# EAGLE design oled_block (EAGLE 6.6.0)

## Sheet 1 of 2
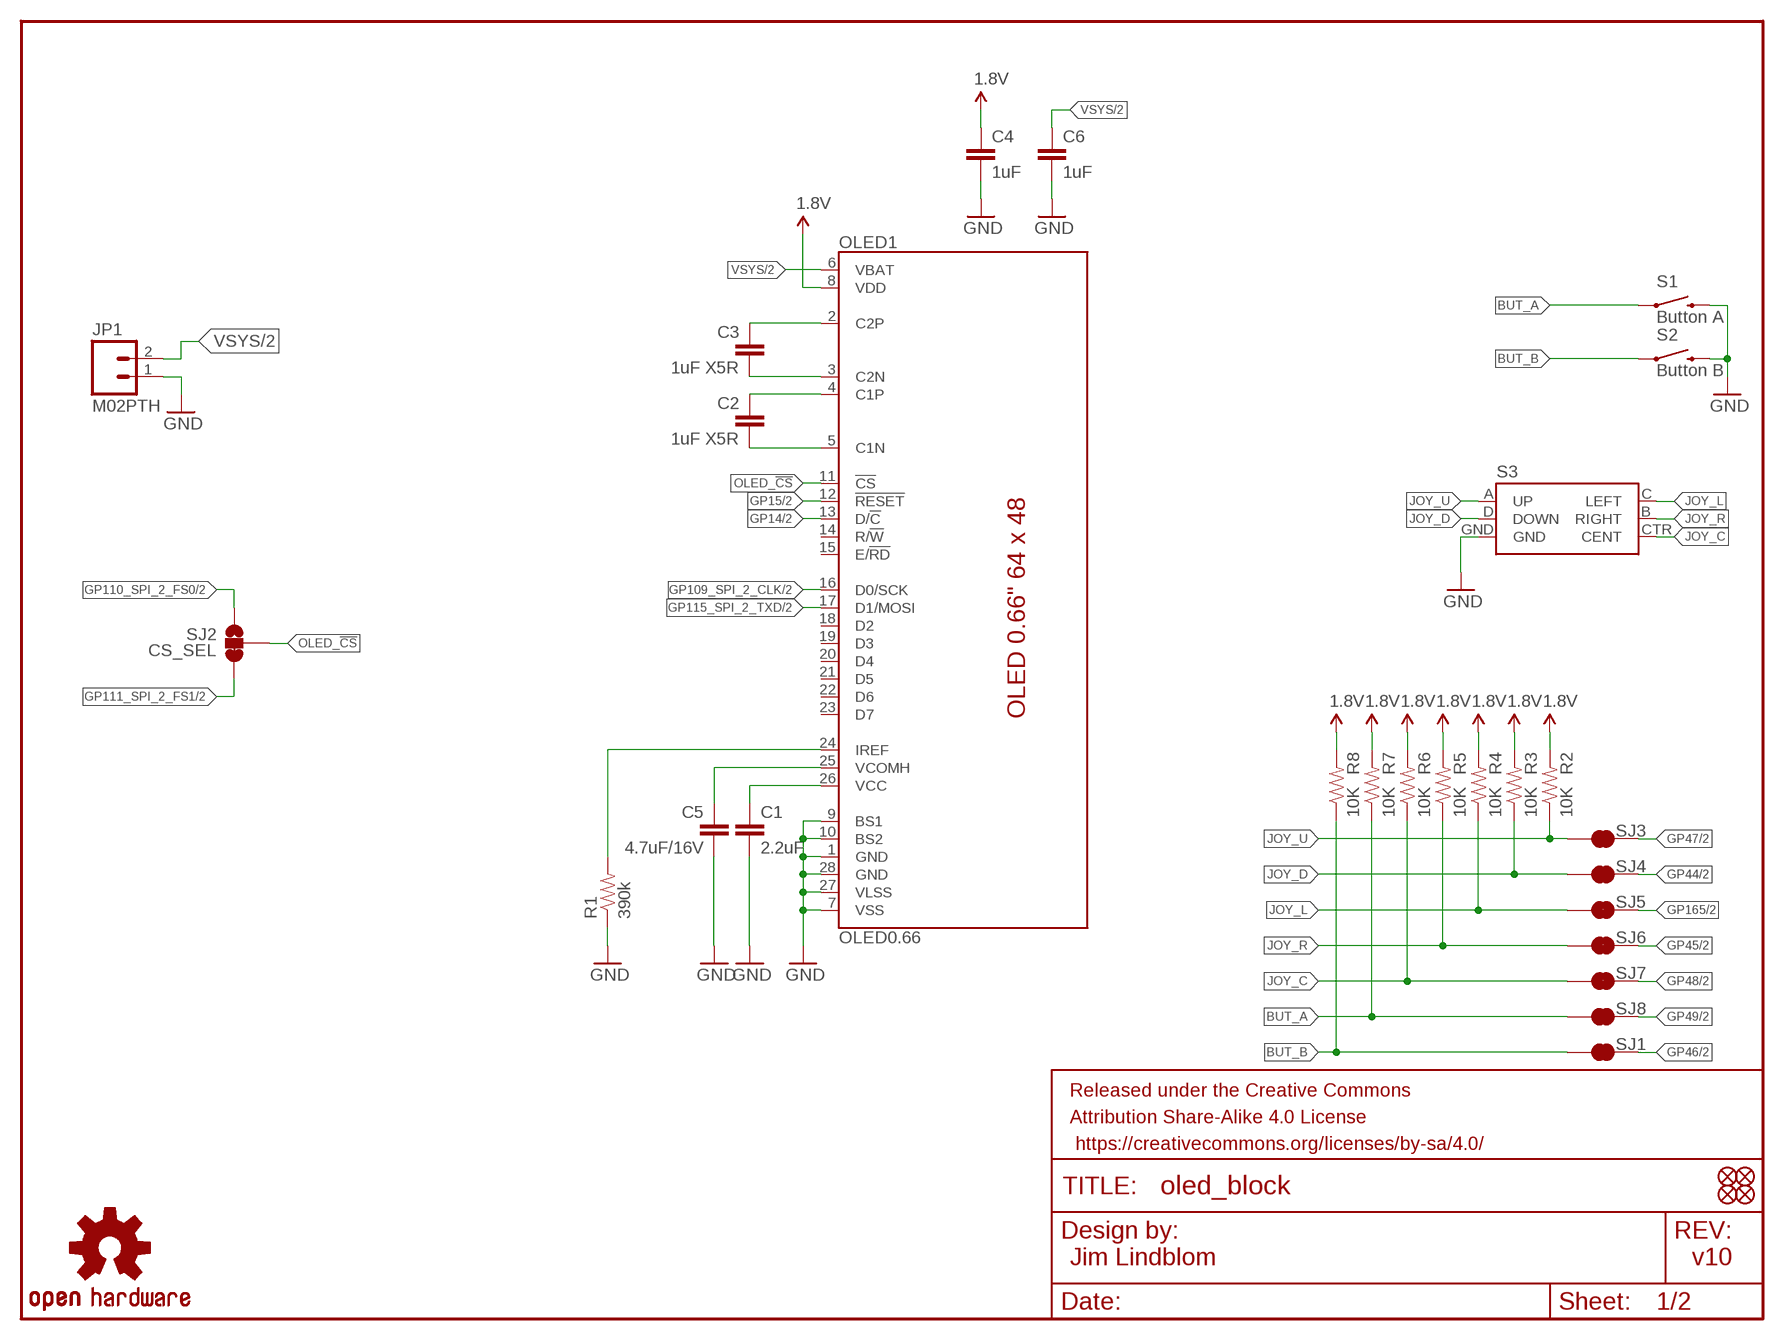
[diagram p0: schematic, sheet 1]

### Parts
C1  2.2uF  CAP0805  [0805]
C2  1uF X5R  CAP0805  [0805]
C3  1uF X5R  CAP0805  [0805]
C4  1uF  CAP0603-CAP  [0603-CAP]
C5  4.7uF/16V  CAP1206  [1206]
C6  1uF  CAP0603-CAP  [0603-CAP]
FID1  FIDUCIAL1X2  [FIDUCIAL-1X2]
FID2  FIDUCIAL1X2  [FIDUCIAL-1X2]
FID3  FIDUCIAL1X2  [FIDUCIAL-1X2]
FID4  FIDUCIAL1X2  [FIDUCIAL-1X2]
FRAME1  FRAME-LETTER  [CREATIVE_COMMONS]
JP1  M02PTH  [1X02]
LOGO2  OSHW-LOGOS  [OSHW-LOGO-S]
OLED1  OLED0.66  [OLED-0.66-64X48]
R1  390k  RESISTOR0603-RES  [0603-RES]
R2  10K  10KOHM1/10W1%(0603)0603  [0603-RES]
R3  10K  10KOHM1/10W1%(0603)0603  [0603-RES]
R4  10K  10KOHM1/10W1%(0603)0603  [0603-RES]
R5  10K  10KOHM1/10W1%(0603)0603  [0603-RES]
R6  10K  10KOHM1/10W1%(0603)0603  [0603-RES]
R7  10K  10KOHM1/10W1%(0603)0603  [0603-RES]
R8  10K  10KOHM1/10W1%(0603)0603  [0603-RES]
S1  Button A  SWITCH-MOMENTARY-2SMD-4  [TACTILE_SWITCH_TALL]
S2  Button B  SWITCH-MOMENTARY-2SMD-4  [TACTILE_SWITCH_TALL]
S3  JOYSTICK_MINI  [JOYSTICK_MINI]
SJ1  JUMPER-PAD-2-NC_BY_TRACE  [PAD-JUMPER-2-NC_BY_TRACE_YES_SILK]
SJ2  CS_SEL  JUMPER-PAD-3-2OF3_NC_BY_TRACE  [PAD-JUMPER-3-2OF3_NC_BY_TRACE_YES_SILK_FULL_BOX]
SJ3  JUMPER-PAD-2-NC_BY_TRACE  [PAD-JUMPER-2-NC_BY_TRACE_YES_SILK]
SJ4  JUMPER-PAD-2-NC_BY_TRACE  [PAD-JUMPER-2-NC_BY_TRACE_YES_SILK]
SJ5  JUMPER-PAD-2-NC_BY_TRACE  [PAD-JUMPER-2-NC_BY_TRACE_YES_SILK]
SJ6  JUMPER-PAD-2-NC_BY_TRACE  [PAD-JUMPER-2-NC_BY_TRACE_YES_SILK]
SJ7  JUMPER-PAD-2-NC_BY_TRACE  [PAD-JUMPER-2-NC_BY_TRACE_YES_SILK]
SJ8  JUMPER-PAD-2-NC_BY_TRACE  [PAD-JUMPER-2-NC_BY_TRACE_YES_SILK]

### Nets
1.8V: C4.1 OLED1.8(VDD) R2.2 R3.2 R4.2 R5.2 R6.2 R7.2 R8.2 ; also sheet 2
BUT_A: R7.1 S1.A2 SJ8.1
BUT_B: R8.1 S2.A2 SJ1.1
C1N: C2.2 OLED1.5(C1N)
C1P: C2.1 OLED1.4(C1P)
C2N: C3.2 OLED1.3(C2N)
C2P: C3.1 OLED1.2(C2P)
GND: C1.2 C4.2 C5.2 C6.2 JP1.1 OLED1.1(GND) OLED1.7(VSS) OLED1.9(BS1) OLED1.10(BS2) OLED1.27(VLSS) OLED1.28(GND) R1.1 S1.B2 S2.B2 S3.GND ; also sheet 2
GP14: OLED1.13(D/!C!) ; also sheet 2
GP15: OLED1.12(!RESET!) ; also sheet 2
GP44: SJ4.2 ; also sheet 2
GP45: SJ6.2 ; also sheet 2
GP46: SJ1.2 ; also sheet 2
GP47: SJ3.2 ; also sheet 2
GP48: SJ7.2 ; also sheet 2
GP49: SJ8.2 ; also sheet 2
GP109_SPI_2_CLK: OLED1.16(D0/SCK) ; also sheet 2
GP110_SPI_2_FS0: SJ2.1 ; also sheet 2
GP111_SPI_2_FS1: SJ2.3 ; also sheet 2
GP115_SPI_2_TXD: OLED1.17(D1/MOSI) ; also sheet 2
GP165: SJ5.2 ; also sheet 2
IREF: OLED1.24(IREF) R1.2
JOY_C: R6.1 S3.CTR(CENT) SJ7.1
JOY_D: R3.1 S3.D(DOWN) SJ4.1
JOY_L: R4.1 S3.C(LEFT) SJ5.1
JOY_R: R5.1 S3.B(RIGHT) SJ6.1
JOY_U: R2.1 S3.A(UP) SJ3.1
OLED_!CS!: OLED1.11(!CS!) SJ2.2
VCC: C1.1 OLED1.26(VCC)
VCOMH: C5.1 OLED1.25(VCOMH)
VSYS: C6.1 JP1.2 OLED1.6(VBAT) ; also sheet 2
Unconnected: OLED1.14(R/!W!) OLED1.15(E/!RD!) OLED1.18(D2) OLED1.19(D3) OLED1.20(D4) OLED1.21(D5) OLED1.22(D6) OLED1.23(D7)

### Notes on the sheet
- Jim Lindblom | v10

## Sheet 2 of 2
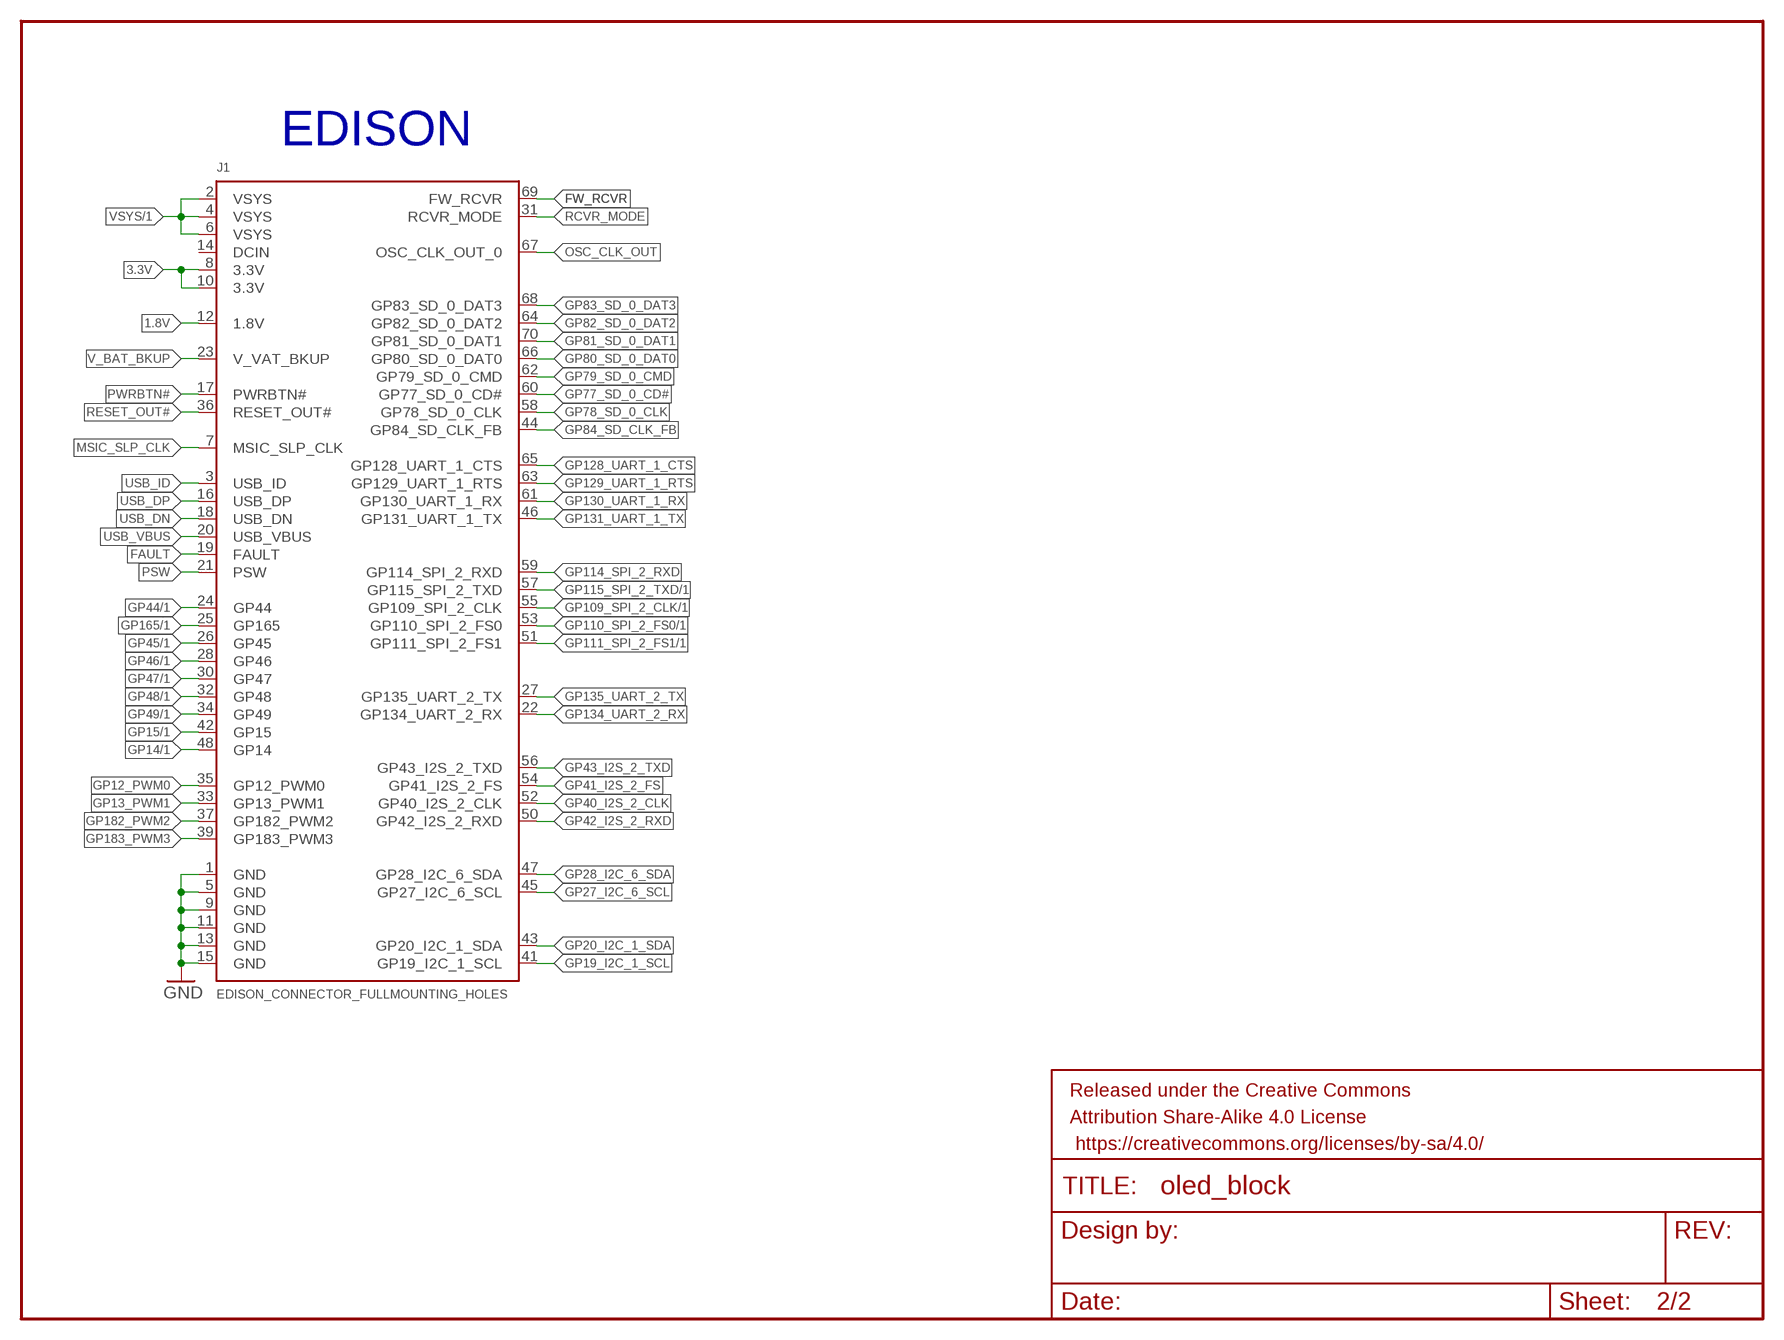
[diagram p1: schematic, sheet 2]

### Parts
FRAME2  FRAME-LETTER  [CREATIVE_COMMONS]
J1  EDISON_CONNECTOR_FULLMOUNTING_HOLES  [EDISON_DAUGHTER]

### Nets
1.8V: J1.12(1.8V) ; also sheet 1
3.3V: J1.8(3.3V) J1.10(3.3V)
FAULT: J1.19(FAULT)
FW_RCVR: J1.69(FW_RCVR)
GND: J1.1(GND) J1.5(GND) J1.9(GND) J1.11(GND) J1.13(GND) J1.15(GND) ; also sheet 1
GP12_PWM0: J1.35(GP12_PWM0)
GP13_PWM1: J1.33(GP13_PWM1)
GP14: J1.48(GP14) ; also sheet 1
GP15: J1.42(GP15) ; also sheet 1
GP19_I2C_1_SCL: J1.41(GP19_I2C_1_SCL)
GP20_I2C_1_SDA: J1.43(GP20_I2C_1_SDA)
GP27_I2C_6_SCL: J1.45(GP27_I2C_6_SCL)
GP28_I2C_6_SDA: J1.47(GP28_I2C_6_SDA)
GP40_I2S_2_CLK: J1.52(GP40_I2S_2_CLK)
GP41_I2S_2_FS: J1.54(GP41_I2S_2_FS)
GP42_I2S_2_RXD: J1.50(GP42_I2S_2_RXD)
GP43_I2S_2_TXD: J1.56(GP43_I2S_2_TXD)
GP44: J1.24(GP44) ; also sheet 1
GP45: J1.26(GP45) ; also sheet 1
GP46: J1.28(GP46) ; also sheet 1
GP47: J1.30(GP47) ; also sheet 1
GP48: J1.32(GP48) ; also sheet 1
GP49: J1.34(GP49) ; also sheet 1
GP77_SD_0_CD#: J1.60(GP77_SD_0_CD#)
GP78_SD_0_CLK: J1.58(GP78_SD_0_CLK)
GP79_SD_0_CMD: J1.62(GP79_SD_0_CMD)
GP80_SD_0_DAT0: J1.66(GP80_SD_0_DAT0)
GP81_SD_0_DAT1: J1.70(GP81_SD_0_DAT1)
GP82_SD_0_DAT2: J1.64(GP82_SD_0_DAT2)
GP83_SD_0_DAT3: J1.68(GP83_SD_0_DAT3)
GP84_SD_CLK_FB: J1.44(GP84_SD_CLK_FB)
GP109_SPI_2_CLK: J1.55(GP109_SPI_2_CLK) ; also sheet 1
GP110_SPI_2_FS0: J1.53(GP110_SPI_2_FS0) ; also sheet 1
GP111_SPI_2_FS1: J1.51(GP111_SPI_2_FS1) ; also sheet 1
GP114_SPI_2_RXD: J1.59(GP114_SPI_2_RXD)
GP115_SPI_2_TXD: J1.57(GP115_SPI_2_TXD) ; also sheet 1
GP128_UART_1_CTS: J1.65(GP128_UART_1_CTS)
GP129_UART_1_RTS: J1.63(GP129_UART_1_RTS)
GP130_UART_1_RX: J1.61(GP130_UART_1_RX)
GP131_UART_1_TX: J1.46(GP131_UART_1_TX)
GP134_UART_2_RX: J1.22(GP134_UART_2_RX)
GP135_UART_2_TX: J1.27(GP135_UART_2_TX)
GP165: J1.25(GP165) ; also sheet 1
GP182_PWM2: J1.37(GP182_PWM2)
GP183_PWM3: J1.39(GP183_PWM3)
MSIC_SLP_CLK: J1.7(MSIC_SLP_CLK)
OSC_CLK_OUT: J1.67(OSC_CLK_OUT_0)
PSW: J1.21(PSW)
PWRBTN#: J1.17(PWRBTN#)
RCVR_MODE: J1.31(RCVR_MODE)
RESET_OUT#: J1.36(RESET_OUT#)
USB_DN: J1.18(USB_DN)
USB_DP: J1.16(USB_DP)
USB_ID: J1.3(USB_ID)
USB_VBUS: J1.20(USB_VBUS)
V_BAT_BKUP: J1.23(V_VAT_BKUP)
VSYS: J1.2(VSYS) J1.4(VSYS) J1.6(VSYS) ; also sheet 1
Unconnected: J1.14(DCIN)

### Notes on the sheet
- EDISON

## Library data of the parts
C1-C6 = SparkFun-Passives:CAP: Capacitor Standard 0603 ceramic capacitor, and 0.1" leaded capacitor.
FID1-FID4 = SparkFun-Aesthetics:FIDUCIAL: Fiducial Alignment Points Various fiducial points for machine vision alignment.
FRAME1 FRAME2 = SparkFun-Aesthetics:FRAME-LETTER: Schematic Frame Standard 8.5x11 US Letter frame
J1 = Edison:EDISON_CONNECTOR_FULL
JP1 = SparkFun-Connectors:M02: Standard 2-pin 0.1" header. Use with - straight break away headers ( PRT-00116) - right angle break away headers (PRT-00553) - swiss pins (PRT-00743) - machine pins (PRT-00117) - female headers (PRT-00115) Molex polarized connector foot print use with: PRT-08233 with associated crimp pins and housings. 2.54_SCREWTERM for use with PRT-10571. 3.5mm Screw Terminal footprints for PRT-08084 5mm Screw Terminal footprints for use with PRT-08432
LOGO2 = SparkFun-Aesthetics:OSHW-LOGO: Open Source Hardware Logo This logo indicates the piece of hardware it is found on incorporates a OSHW license and/or adheres to the definition of open source hardware found here: http://freedomdefined.org/OSHW
OLED1 = SparkFun-Displays:OLED0.66
R1 = SparkFun-Passives:RESISTOR: Resistor Basic schematic elements and footprints for 0603, 1206, and PTH resistors.
R2-R8 = SparkFun-Resistors:10KOHM1/10W1%(0603): RES-00824; PROD_ID: RES-00824
S1 S2 = SparkFun-Electromechanical:SWITCH-MOMENTARY-2: Various NO switches- pushbuttons, reed, etc; PROD_ID: SWCH-11966
S3 = SparkFun-Electromechanical:JOYSTICK_MINI: Small 5-way tactile joystick, COM-10063 4UCON SF303GJ26
SJ1 SJ3-SJ8 = SparkFun-Passives:JUMPER-PAD-2-NC_BY_TRACE
SJ2 = SparkFun-Passives:JUMPER-PAD-3-2OF3_NC_BY_TRACE

## Board
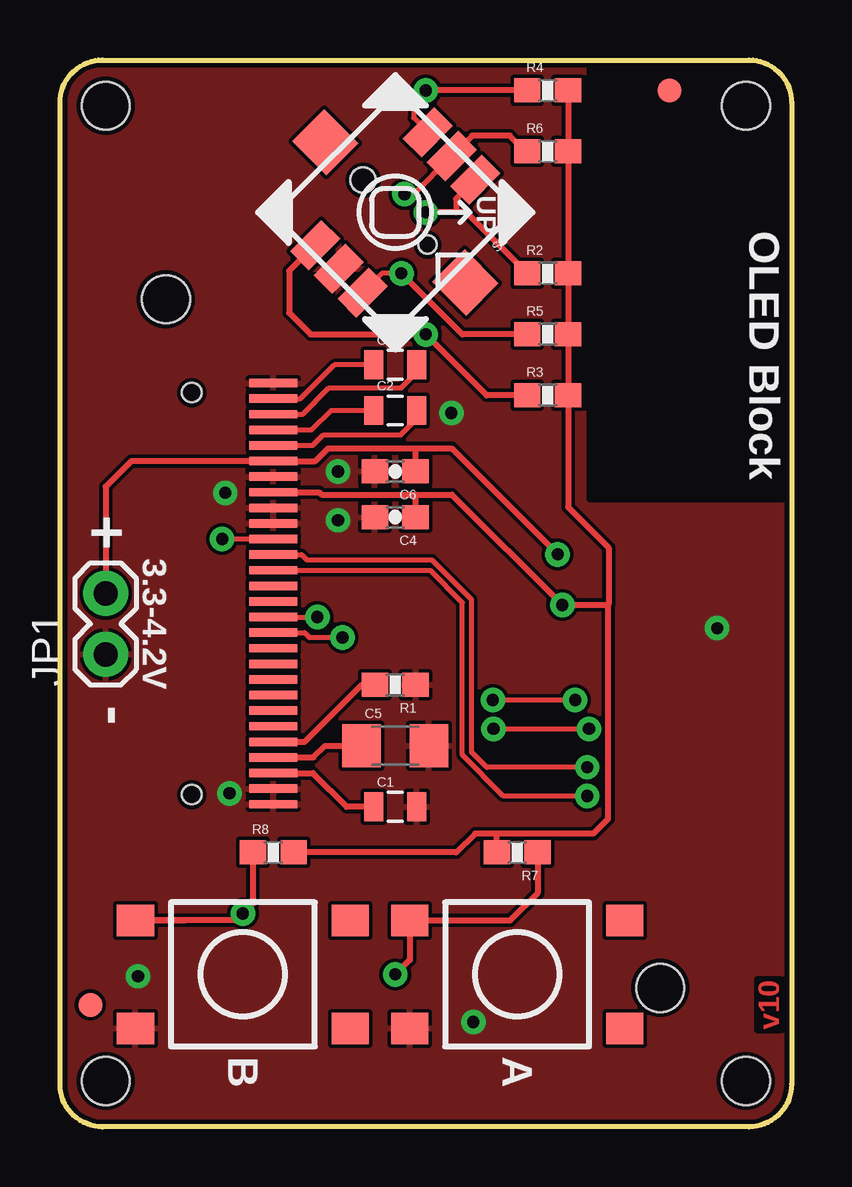
[diagram p2: board, top side]
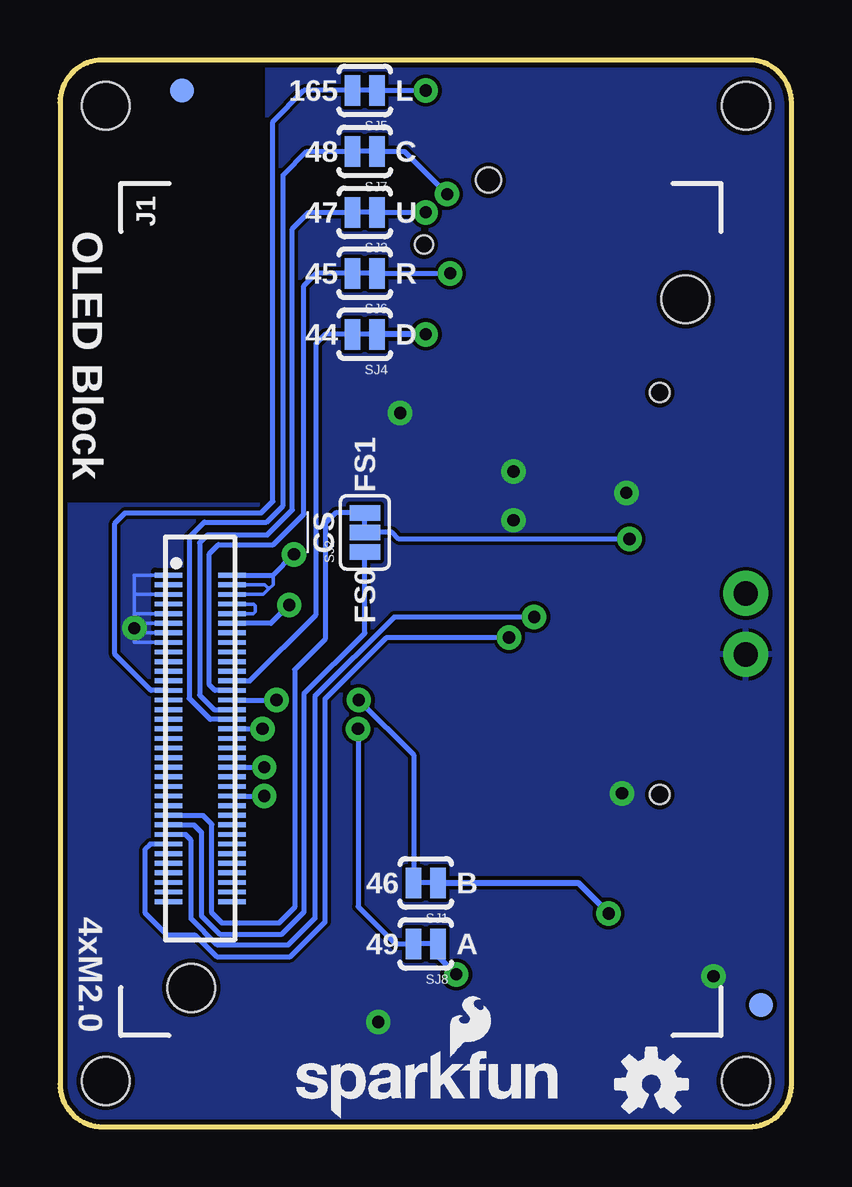
[diagram p3: board, bottom side, seen from below]

Size 30.48 x 44.45 mm. Coordinates in mm from the lower left corner, seen from the top.
Outline: 30.48,42.67 30.48,1.78 arc-90 28.7,0 1.78,0 arc-90 0,1.78 0,42.67 arc-90 1.78,44.45 28.7,44.45 arc-90 30.48,42.67
Copper layers (1*16): Top 0.035mm / dielectric 1.5mm / Bottom 0.035mm
Design rules "SparkFun-2-layer *": minimum track width 6mil, minimum drill 13mil, track to track 6mil, track to pad 6mil, pad to pad 6mil, via to via 6mil, smd to smd 6mil, copper to edge 8mil, drill to drill 8mil, minimum pad ring 12mil, minimum via ring 10mil, stop-mask expansion 4mil, vias tented up to drill 20mil, thermal gap 6mil
Holes 2 mm at 28.57,1.91 1.91,1.91 1.91,42.55 28.57,42.55
tRestrict: area 22.1,26.2 to 30.5,44.5
bRestrict: area 22.1,26.2 to 30.5,44.5

### Footprints (pad centres in the part's own frame; a part is rotated, then mirrored left to right if it is on the bottom)
0805 = smd 0.8 x 1.2: 1 -0.9,0; 2 0.9,0
0603-CAP = smd 1.1 x 1: 1 -0.85,0; 2 0.85,0
1206 = smd 1.6 x 1.8: 1 -1.4,0; 2 1.4,0
FIDUCIAL-1X2 = smd 1 x 1: 1 0,0
EDISON_DAUGHTER = smd 1.14 x 0.2: 1 1.98,19.17; 2 4.62,19.17; 3 1.98,18.77; 4 4.62,18.77; 5 1.98,18.37; 6 4.62,18.37; 7 1.98,17.97; 8 4.62,17.97; 9 1.98,17.57; 10 4.62,17.57; 11 1.98,17.17; 12 4.62,17.17; 13 1.98,16.77; 14 4.62,16.77; 15 1.98,16.37; 16 4.62,16.37; 17 1.98,15.97; 18 4.62,15.97; 19 1.98,15.57; 20 4.62,15.57; 21 1.98,15.17; 22 4.62,15.17; 23 1.98,14.77; 24 4.62,14.77; 25 1.98,14.37; 26 4.62,14.37; 27 1.98,13.97; 28 4.62,13.97; 29 1.98,13.57; 30 4.62,13.57; 31 1.98,13.17; 32 4.62,13.17; 33 1.98,12.77; 34 4.62,12.77; 35 1.98,12.37; 36 4.62,12.37; 37 1.98,11.97; 38 4.62,11.97; 39 1.98,11.57; 40 4.62,11.57; 41 1.98,11.17; 42 4.62,11.17; 43 1.98,10.77; 44 4.62,10.77; 45 1.98,10.37; 46 4.62,10.37; 47 1.98,9.97; 48 4.62,9.97; 49 1.98,9.57; 50 4.62,9.57; 51 1.98,9.17; 52 4.62,9.17; 53 1.98,8.77; 54 4.62,8.77; 55 1.98,8.37; 56 4.62,8.37; 57 1.98,7.97; 58 4.62,7.97; 59 1.98,7.57; 60 4.62,7.57; 61 1.98,7.17; 62 4.62,7.17; 63 1.98,6.77; 64 4.62,6.77; 65 1.98,6.37; 66 4.62,6.37; 67 1.98,5.97; 68 4.62,5.97; 69 1.98,5.57; 70 4.62,5.57 | hole 2: 23.53,30.67; 2.93,1.98
1X02 = drill 1.016 pad 1.88: 1 0,0; 2 2.54,0
OLED-0.66-64X48 = smd 0.35 x 2: 1 0,0; 2 0.65,0; 3 1.3,0; 4 1.95,0; 5 2.6,0; 6 3.25,0; 7 3.9,0; 8 4.55,0; 9 5.2,0; 10 5.85,0; 11 6.5,0; 12 7.15,0; 13 7.8,0; 14 8.45,0; 15 9.1,0; 16 9.75,0; 17 10.4,0; 18 11.05,0; 19 11.7,0; 20 12.35,0; 21 13,0; 22 13.65,0; 23 14.3,0; 24 14.95,0; 25 15.6,0; 26 16.25,0; 27 16.9,0; 28 17.55,0 | hole 0.8: 17.15,-3.4; 0.4,-3.4
0603-RES = smd 1.1 x 1: 1 -0.85,0; 2 0.85,0
TACTILE_SWITCH_TALL = smd 1.55 x 1.3: A1 -4.475,-2.25; A2 4.475,-2.25; B1 -4.475,2.25; B2 4.475,2.25
JOYSTICK_MINI = smd 1.85 x 1.1: A -3.325,1.4; B 3.325,1.4; C -3.325,-1.4; CTR -3.325,0; D 3.325,-1.4; GND 3.325,0 | smd 1.9 x 2: NC 0,4.13; NC@0 0,-4.13 | hole 0.75: 0,1.9 | hole 1.05: 0,-1.9
PAD-JUMPER-2-NC_BY_TRACE_YES_SILK = smd 0.635 x 1.27: 1 -0.508,0; 2 0.508,0
PAD-JUMPER-3-2OF3_NC_BY_TRACE_YES_SILK_FULL_BOX = smd 0.635 x 1.27: 1 -0.813,0; 2 0,0; 3 0.813,0

### Placement (x,y rotation side)
C1  13.97,13.34 0 top
C2  13.97,29.84 0 top
C3  13.97,31.75 0 top
C4  13.97,25.4 180 top
C5  13.97,15.88 0 top
C6  13.97,27.3 180 top
FID1  25.4,43.18 0 bottom
FID2  1.27,5.08 0 top
FID3  1.27,5.08 0 bottom
FID4  25.4,43.18 0 top
FRAME1  -1.27,-13.97 0 top  (outside the outline)
FRAME2  -1.27,-13.97 0 top  (outside the outline)
J1  27.94,3.81 0 bottom
JP1  1.91,19.68 90 top
LOGO2  5.84,1.78 0 bottom
LOGO3  SFE_LOGO_NAME_FLAME.1_INCH  [SFE_LOGO_NAME_FLAME_.1]  21.08,0.25 0 bottom
OLED1  8.89,30.99 270 top
R1  13.97,18.41 180 top
R2  20.32,35.56 0 top
R3  20.32,30.48 0 top
R4  20.32,43.18 0 top
R5  20.32,33.02 0 top
R6  20.32,40.64 0 top
R7  19.05,11.43 180 top
R8  8.89,11.43 0 top
S1  19.05,6.35 180 top
S2  7.62,6.35 180 top
S3  13.97,38.1 225 top
SJ1  15.24,10.16 180 bottom
SJ2  17.78,24.77 90 bottom
SJ3  17.78,38.1 180 bottom
SJ4  17.78,33.02 180 bottom
SJ5  17.78,43.18 180 bottom
SJ6  17.78,35.56 180 bottom
SJ7  17.78,40.64 180 bottom
SJ8  15.24,7.62 180 bottom

### Tracks (layer width: path | path; a pad name or v marks a point on that pad's centre or on a via)
1.8V  (via drill 0.51 pad 0.51)
  Top 0.254: OLED1.8 10.8,26.44 10.9,26.34 14.82,26.34 | 14.82,26.34 16.33,26.34 v20.93,21.74 22.84,21.74 | C4.1 14.82,26.34 | R4.2 R6.2 R2.2 R5.2 R3.2 21.17,25.82 22.86,24.13 22.86,21.77 22.84,21.74 | 22.84,21.74 22.84,12.83 22.23,12.22 18.2,12.22 | R8.2 16.51,11.43 17.3,12.22 17.78,12.22 18.2,12.22 | R7.2 18.2,12.22
  Bottom 0.203: J1.12 21.69,20.98 v20.93,21.74
3.3V
  Bottom 0.152: J1.10 22.43,21.38 22.35,21.46 22.35,21.72 22.41,21.78 J1.8
  Bottom 0.203: J1.8 | J1.10
BUT_A  (via drill 0.51)
  Top 0.254: R7.1 19.9,9.74 18.76,8.6 S1.A2 14.57,6.96 v13.97,6.35
  Bottom 0.254: SJ8.1 14.73,7.11 v13.97,6.35
BUT_B  (via drill 0.51)
  Top 0.254: 5.21,8.6 S2.A2 7.33,8.6 v7.62,8.89 8.04,9.31 R8.1
  Bottom 0.203: SJ1.1 14.73,9.65
  Bottom 0.254: SJ1.1 8.89,10.16 v7.62,8.89
C1N
  Top 0.203: OLED1.5 10.53,28.39 10.97,28.83 14.2,28.83 14.87,29.5 C2.2
C1P
  Top 0.203: OLED1.4 10.48,29.04 11.29,29.84 C2.1
C2N
  Top 0.203: OLED1.3 10.11,29.69 11.2,30.79 14.22,30.79 14.87,31.43 C3.2
C2P
  Top 0.203: OLED1.2 10.02,30.34 11.43,31.75 C3.1
GND  (via drill 0.51)
  Bottom 0.152: J1.1 27.38,22.98 27.38,22.18 | J1.5 27.38,22.18 | 27.38,22.18 27.38,21.38 | J1.9 27.38,21.38 | 27.38,21.38 v27.38,20.78 | J1.11 27.38,20.98 v27.38,20.78 | J1.13 27.38,20.58 | 27.38,20.58 v27.38,20.78 | J1.15 27.38,20.18 27.38,20.58
  other vias: 11.58,27.3 16.31,29.74 7.06,13.89 11.58,25.27 3.25,6.27 17.22,4.37 6.88,26.42
  pour Bottom (isolate 0.152, rank 6): 30.48,42.67 30.48,1.78 arc-90 28.7,0 1.78,0 arc-90 0,1.78 0,42.67 arc-90 1.78,44.45 28.7,44.45 arc-90
  pour Top (isolate 0.152, rank 6): 30.48,1.73 arc-90 28.75,0 1.78,0 arc-90 0,1.78 0,42.67 arc-90 1.78,44.45 28.7,44.45 arc-90 30.48,42.67
GP14  (via drill 0.51 pad 0.51)
  Top 0.203: OLED1.13 15.42,23.19 16.76,21.84 16.76,15.49 18.48,13.78 v21.97,13.78
  Bottom 0.203: J1.48 v21.97,13.78
GP15  (via drill 0.51 pad 0.51)
  Top 0.203: OLED1.12 10.07,23.84 10.29,23.62 15.49,23.62 17.14,21.97 17.14,15.62 17.79,14.98 v21.97,14.98
  Bottom 0.203: J1.42 v21.97,14.98
GP44
  Bottom 0.203: J1.24 22.57,18.58 19.81,21.34 19.81,32.64 19.43,33.02 SJ4.2
GP45
  Bottom 0.203: J1.26 24.02,18.18 24.26,18.41 24.26,23.88 23.88,24.26 21.59,24.26 20.32,25.53 20.32,35.05 19.81,35.56 SJ6.2
GP46  (via drill 0.51, 0.51 pad 0.51)
  Top 0.203: v21.46,17.78 v18.03,17.78
  Bottom 0.203: J1.28 v21.46,17.78 | v18.03,17.78 15.75,15.49 SJ1.2
GP47
  Bottom 0.203: J1.30 24.06,17.38 24.66,17.98 24.66,24.33 24.33,24.66 21.84,24.66 20.8,25.7 20.8,37.41 20.12,38.1 SJ3.2
GP48
  Bottom 0.203: J1.32 | J1.32 24.22,16.98 25.09,17.86 25.09,24.56 24.46,25.2 21.87,25.2 21.18,25.88 21.18,39.65 20.19,40.64 SJ7.2
GP49  (via drill 0.51 pad 0.51)
  Top 0.203: v18.06,16.58 v22.04,16.58
  Bottom 0.203: SJ8.2 16.51,7.62 18.06,9.17 v18.06,16.58 | J1.34 v22.04,16.58
GP109_SPI_2_CLK  (via drill 0.51)
  Top 0.203: OLED1.16 v10.72,21.24
  Bottom 0.203: J1.55 | J1.55 25.26,12.18 25.02,11.94 25.02,8.66 23.93,7.57 20.98,7.57 19.86,8.69 19.86,17.93 16.56,21.24 v10.72,21.24
GP110_SPI_2_FS0
  Bottom 0.203: J1.53 24.9,12.58 24.59,12.27 24.59,8.79 23.82,8.03 21.23,8.03 20.32,8.94 20.32,18.03 17.78,20.57 SJ2.1
GP111_SPI_2_FS1
  Bottom 0.203: J1.51 24.54,12.98 24.16,12.6 24.16,8.91 23.72,8.48 21.36,8.48 20.7,9.14 20.7,19.05 19.43,20.32 19.43,25.15 19,25.58 SJ2.3
GP115_SPI_2_TXD  (via drill 0.51)
  Top 0.203: OLED1.17 10.2,20.59 10.4,20.39 v11.77,20.39
  Bottom 0.203: v11.77,20.39 16.88,20.39 19.43,17.83 19.43,8.53 20.88,7.09 23.95,7.09 24.84,7.98 26.01,7.98 26.92,8.89 26.92,11.58 26.73,11.78 J1.57
GP165
  Bottom 0.203: SJ5.2 20.32,43.18 21.61,41.88 21.61,26.06 22.1,25.58 27.76,25.58 28.19,25.15 28.19,19.68 26.69,18.18 J1.25
IREF
  Top 0.254: OLED1.24 10.2,16.04 12.57,18.41 R1.2
JOY_C  (via drill 0.51 pad 0.51)
  Top 0.203: v14.35,38.86 14.73,38.86 S3.CTR
  Top 0.254: R6.1 19.41,40.64 18.75,41.3 17.17,41.3 S3.CTR
  Bottom 0.203: SJ7.1 16.13,40.64 v14.35,38.86
JOY_D  (via drill 0.51)
  Top 0.254: S3.D 9.55,35.66 9.55,33.91 10.44,33.02 v15.24,33.02 17.78,30.48 R3.1
  Bottom 0.254: v15.24,33.02 SJ4.1
JOY_L  (via drill 0.51 pad 0.51)
  Top 0.203: v15.24,43.18 14.73,42.67 14.73,42.04 S3.C
  Top 0.254: R4.1 v15.24,43.18
  Bottom 0.203: SJ5.1 v15.24,43.18
JOY_R  (via drill 0.51 pad 0.51)
  Top 0.203: v14.22,35.56 13.41,35.56 S3.B
  Top 0.254: R5.1 16.76,33.02 v14.22,35.56
  Bottom 0.203: SJ6.1 v14.22,35.56
JOY_U  (via drill 0.51 pad 0.51)
  Top 0.203: v15.24,38.1 15.95,38.1
  Top 0.254: R2.1 16.93,38.1 16.51,38.1 | 16.51,38.1 v15.24,38.1 | S3.A 16.51,38.66 16.51,38.1
  Bottom 0.203: SJ3.1 v15.24,38.1
OLED_!CS!  (via drill 0.51 pad 0.51)
  Top 0.203: OLED1.11 v6.75,24.49
  Bottom 0.203: SJ2.2 16.64,24.77 16.36,24.49 v6.75,24.49
VCC
  Top 0.254: OLED1.26 10.54,14.74 11.94,13.34 C1.1
VCOMH
  Top 0.254: OLED1.25 10.56,15.39 11.05,15.88 C5.1
VSYS  (via drill 0.51)
  Top 0.254: 14.88,28.27 11.18,28.27 10.64,27.74 OLED1.6 2.97,27.74 1.91,26.67 JP1.2 | 14.88,28.27 16.31,28.27 v20.73,23.85 | C6.1 14.82,28.21 14.88,28.27
  Bottom 0.152: J1.6 22.02,22.18 21.78,22.42 | 21.78,22.42 21.6,22.59 21.6,22.98 | J1.4 21.95,22.58 21.78,22.42
  Bottom 0.203: J1.2 21.6,22.98 v20.73,23.85

### Text on the board
Top: v10
tPlace: OLED Block | + | 3.3-4.2V | - | B | A
bPlace: L | 165 | C | 48 | U | 47 | OLED Block | R | 45 | D | 44 | FS1 | !CS! | FS0 | B | 46 | A | 49 | 4xM2.0
tDocu: Jim Lindblom